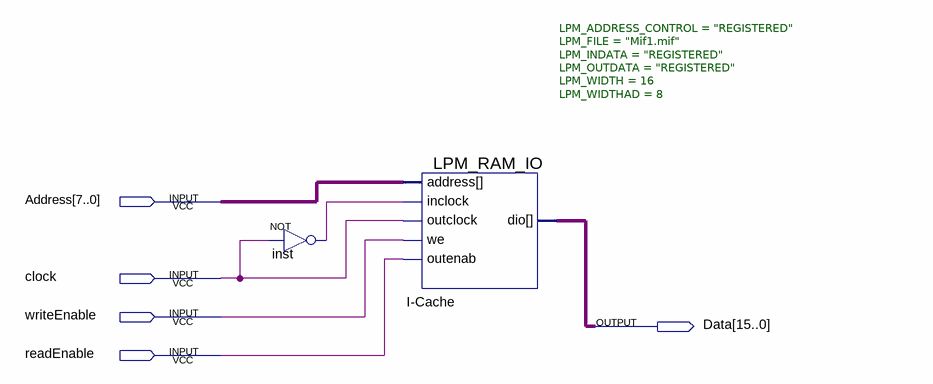
[diagram p0: schematic sheet]
// Quartus schematic ICache.bdf as structural Verilog: 2 symbols, 5 pins
module ICache (
  input  [7:0] Address,
  input  clock,
  input  writeEnable,
  input  readEnable,
  output [15:0] Data
);

  wire inst_out;

  not inst (inst_out, clock);
  LPM_RAM_IO #(.LPM_ADDRESS_CONTROL("REGISTERED"), .LPM_FILE("Mif1.mif"), .LPM_INDATA("REGISTERED"), .LPM_OUTDATA("REGISTERED"), .LPM_WIDTH(16), .LPM_WIDTHAD(8)) \I-Cache  (
    .address(Address), .inclock(inst_out), .outclock(clock), .outenab(readEnable), .we(writeEnable),
    .dio(Data));
endmodule
